# EAGLE schematic Arduino-Pro-v16 (EAGLE 7.6.0)
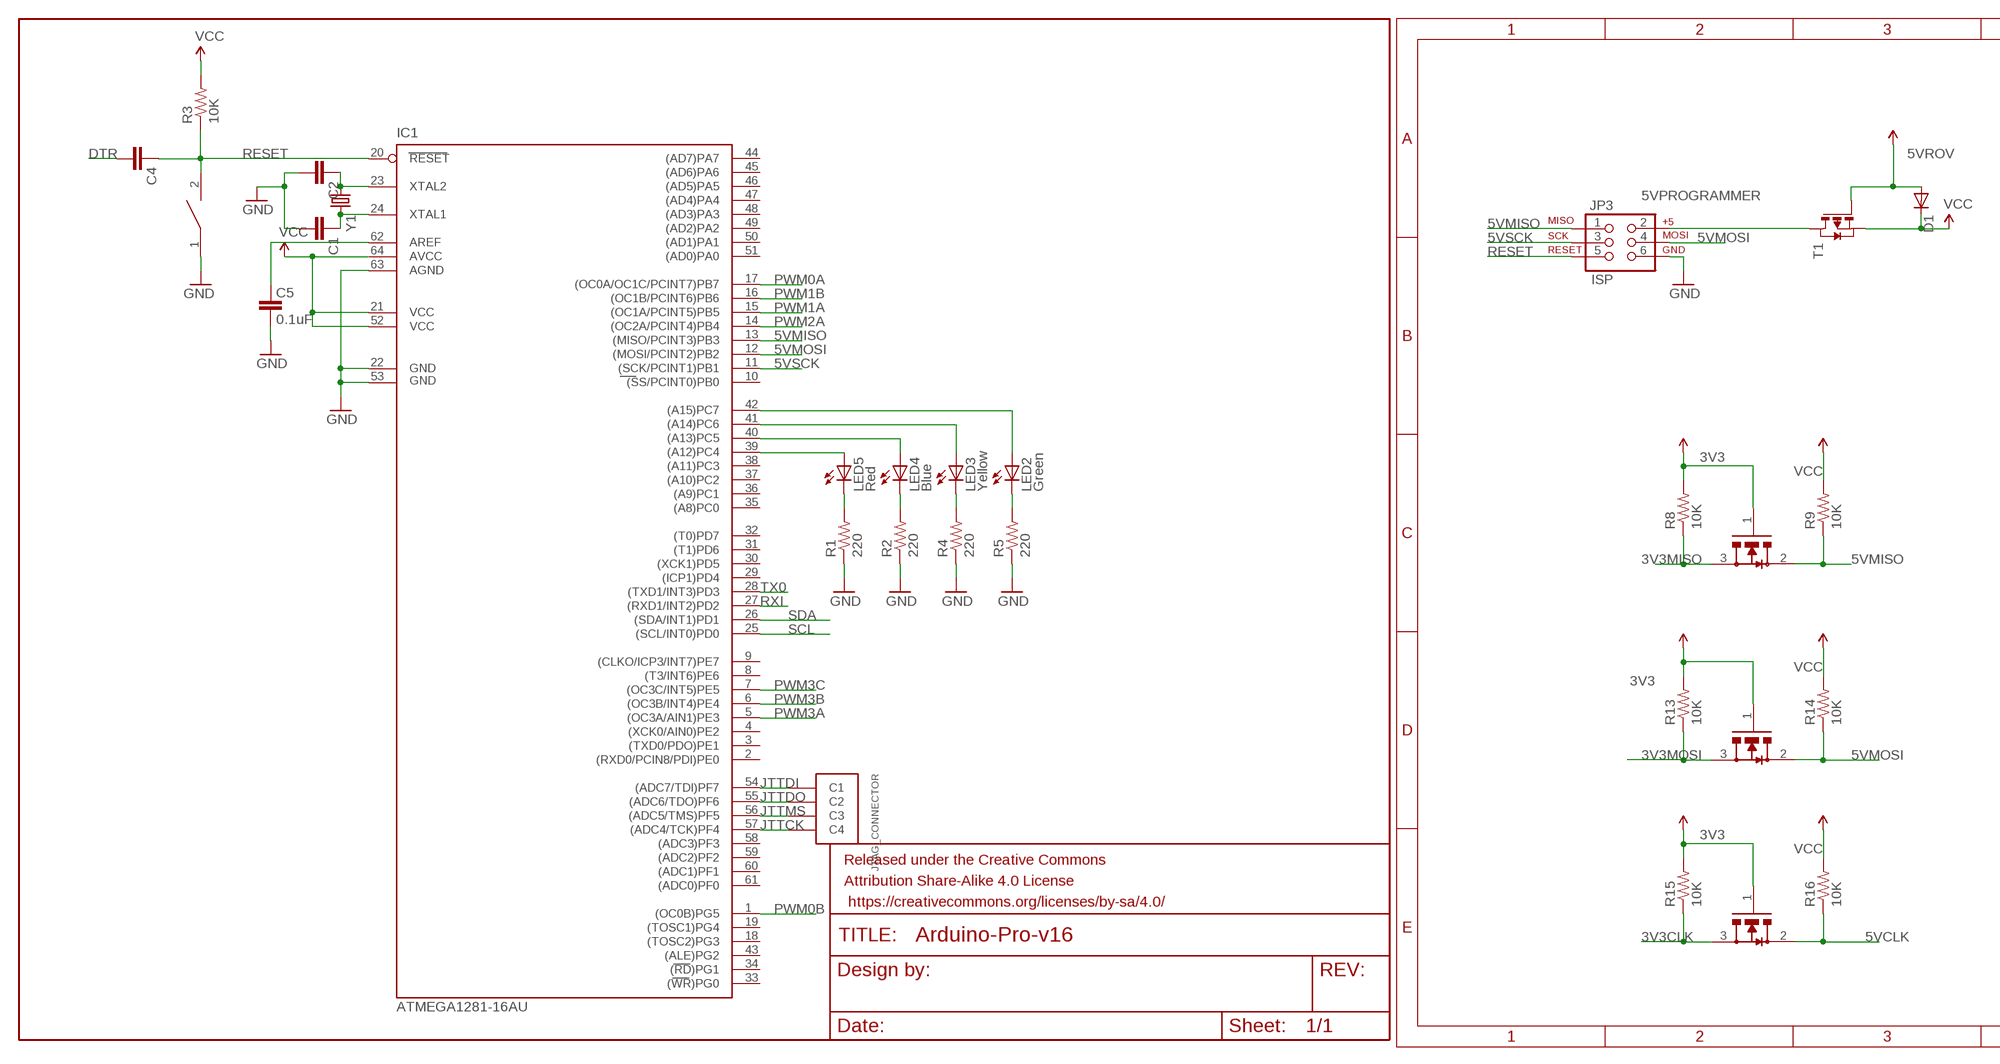
[diagram p0: schematic, sheet 1, part 1 of 2]
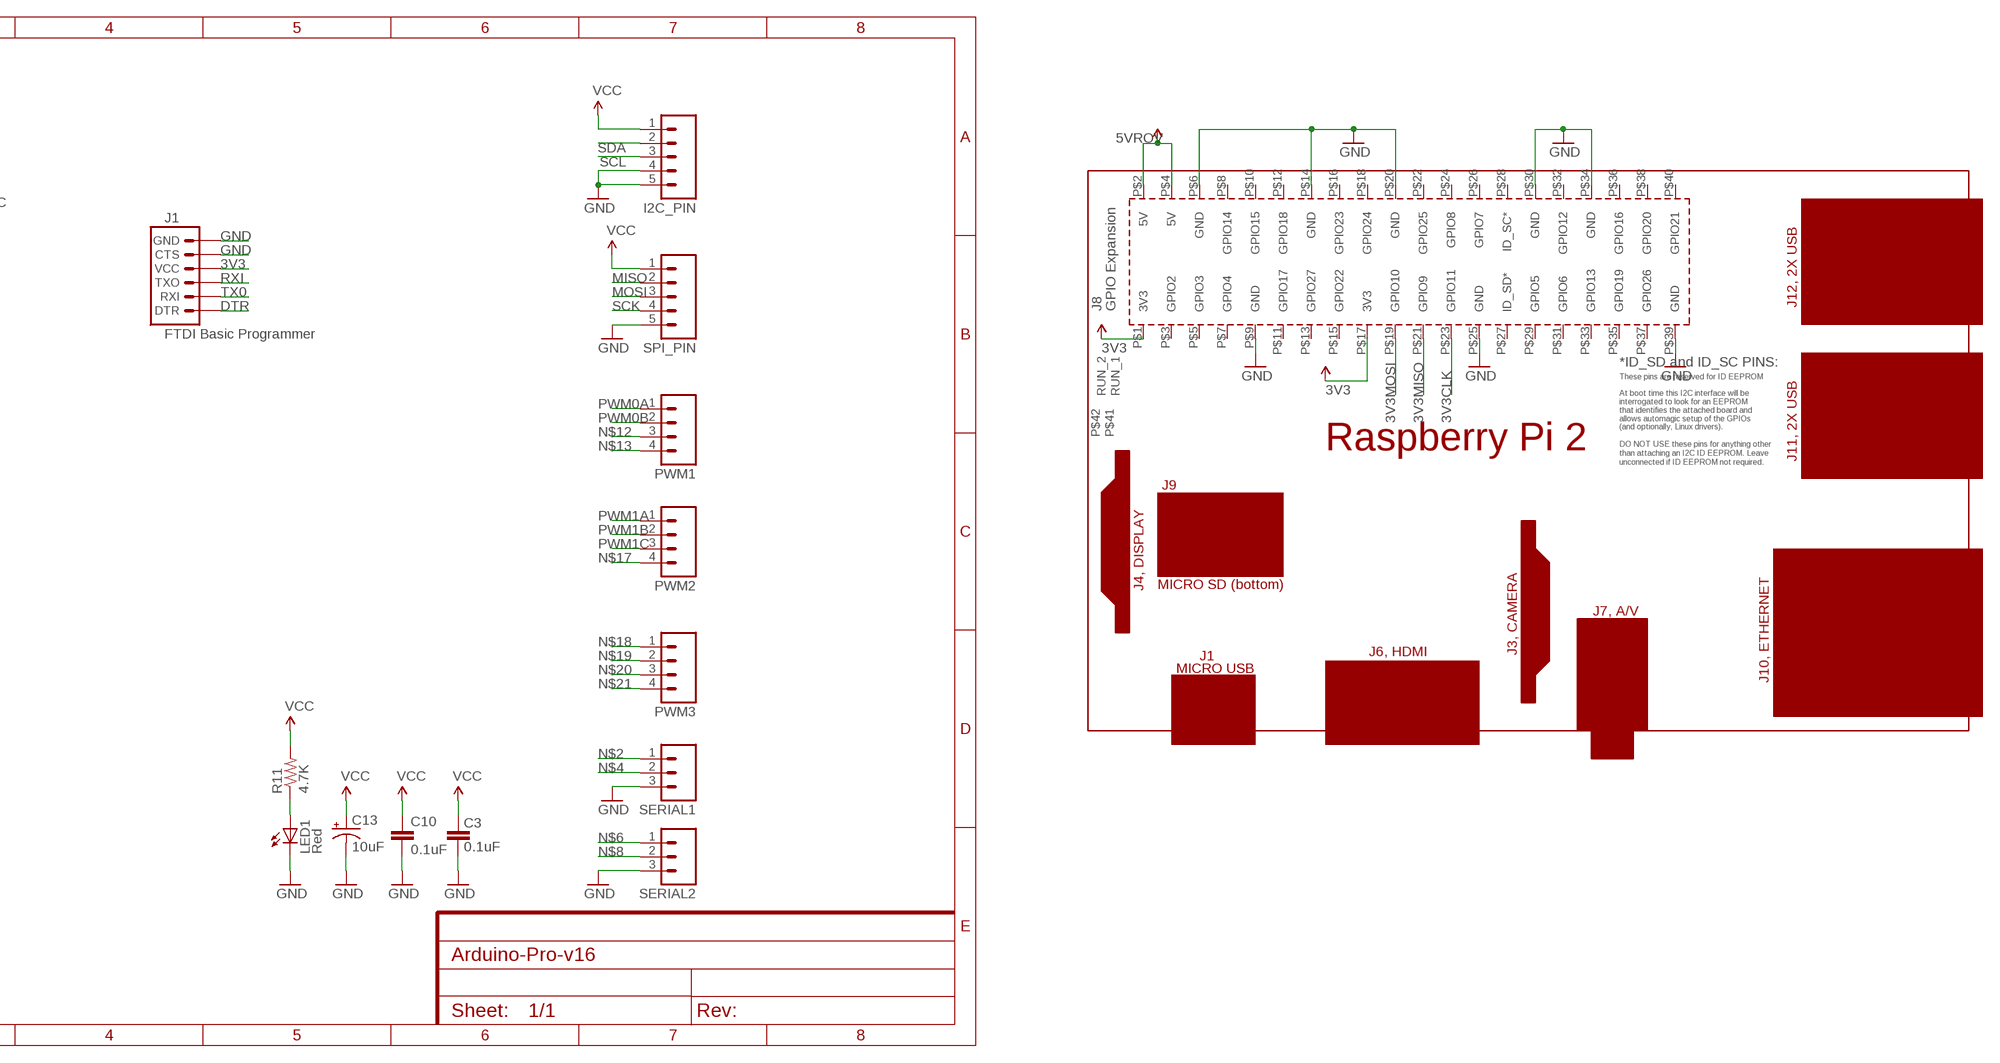
[diagram p1: schematic, sheet 1, part 2 of 2]

## Parts
C1  CAP0603-CAP  [0603-CAP]
C2  CAP0603-CAP  [0603-CAP]
C3  0.1uF  CAP0402-CAP  [0402-CAP]
C4  CAP0603-CAP  [0603-CAP]
C5  0.1uF  CAP0402-CAP  [0402-CAP]
C10  0.1uF  CAP0402-CAP  [0402-CAP]
C13  10uF  CAP_POL1206  [EIA3216]
D1  DIODE-DO-214AC  [DO-214AC]
FRAME1  FRAME-LETTER  [CREATIVE_COMMONS]
I2C_PIN  M05PTH  [1X05]
IC1  ATMEGA1281-16AU  [TQFP64]
J1  FTDI Basic Programmer  ARDUINO_SERIAL_PROGRAMPTH  [1X06]
JP3  ISP  AVR_SPI_PRG_6PTH  [2X3]
JTAG_CONNECTOR  MICRO-FIT-4-SMD-PART  [MICRO-FIT-4-SMD]
LED1  Red  LED0603  [LED-0603]
LED2  Green  LED0603  [LED-0603]
LED3  Yellow  LED0603  [LED-0603]
LED4  Blue  LED0603  [LED-0603]
LED5  Red  LED0603  [LED-0603]
PCB1  RPI2  [RPI2]
PWM1  M04PTH  [1X04]
PWM2  M04PTH  [1X04]
PWM3  M04PTH  [1X04]
R1  220  RESISTOR0402-RES  [0402-RES]
R2  220  RESISTOR0402-RES  [0402-RES]
R3  10K  RESISTOR0603-RES  [0603-RES]
R4  220  RESISTOR0402-RES  [0402-RES]
R5  220  RESISTOR0402-RES  [0402-RES]
R8  10K  RESISTOR0402-RES  [0402-RES]
R9  10K  RESISTOR0402-RES  [0402-RES]
R11  4.7K  RESISTOR0402-RES  [0402-RES]
R13  10K  RESISTOR0402-RES  [0402-RES]
R14  10K  RESISTOR0402-RES  [0402-RES]
R15  10K  RESISTOR0402-RES  [0402-RES]
R16  10K  RESISTOR0402-RES  [0402-RES]
SERIAL1  M03PTH  [1X03]
SERIAL2  M03PTH  [1X03]
SPI_PIN  M05PTH  [1X05]
T1  FDN340P  [SOT-23]
U$1  SWITCH  [SW_2512]
U$3  BSS138  [SOT-23-BSS138]
U$4  BSS138  [SOT-23-BSS138]
U$6  BSS138  [SOT-23-BSS138]
Y1  CRYSTALHC49US  [HC49US]

## Nets
3V3: J1.4(VCC) PCB1.P$1(3V3) PCB1.P$17(3V3) R8.2 R13.2 R15.2 U$3.1(G) U$4.1(G) U$6.1(G) ; supply symbol labelled VCCA
3V3CLK: PCB1.P$23(GPIO11) R15.1 U$6.3(S)
3V3MISO: PCB1.P$21(GPIO9) R8.1 U$3.3(S)
3V3MOSI: PCB1.P$19(GPIO10) R13.1 U$4.3(S)
5VCLK: R16.1 U$6.2(D)
5VMISO: IC1.13((MISO/PCINT3)PB3) JP3.1 R9.1 U$3.2(D)
5VMOSI: IC1.12((MOSI/PCINT2)PB2) JP3.4 R14.1 U$4.2(D)
5VPROGRAMMER: JP3.2 T1.1(D)
5VROV: D1.A PCB1.P$2(5V) PCB1.P$4(5V) T1.3(G) ; supply symbol labelled VCCA
5VSCK: IC1.11((SCK/PCINT1)PB1) JP3.3
DTR: C4.2 J1.1(DTR)
GND [vcc]: C1.2 C2.2 C3.1 C5.1 C10.2 C13.C(-) I2C_PIN.4 I2C_PIN.5 IC1.22(GND) IC1.53(GND1) IC1.63(AGND) J1.5(CTS) J1.6(GND) JP3.6 LED1.C PCB1.P$6(GND) PCB1.P$9(GND) PCB1.P$14(GND) PCB1.P$20(GND) PCB1.P$25(GND) PCB1.P$30(GND) PCB1.P$34(GND) PCB1.P$39(GND) R1.1 R2.1 R4.1 R5.1 SERIAL1.3 SERIAL2.3 SPI_PIN.5 U$1.1
JTTCK: IC1.57((ADC4/TCK)PF4) JTAG_CONNECTOR.C4
JTTDI: IC1.54((ADC7/TDI)PF7) JTAG_CONNECTOR.C1
JTTDO: IC1.55((ADC6/TDO)PF6) JTAG_CONNECTOR.C2
JTTMS: IC1.56((ADC5/TMS)PF5) JTAG_CONNECTOR.C3
MISO: SPI_PIN.2
MOSI: SPI_PIN.3
N$1: C1.1 IC1.24(XTAL1) Y1.2
N$2: SERIAL1.1
N$3: C2.1 IC1.23(XTAL2) Y1.1
N$4: SERIAL1.2
N$5: IC1.39((A12)PC4) LED5.A
N$6: SERIAL2.1
N$7: C5.2 IC1.62(AREF)
N$8: SERIAL2.2
N$9: IC1.40((A13)PC5) LED4.A
N$10: IC1.41((A14)PC6) LED3.A
N$11: IC1.42((A15)PC7) LED2.A
N$12: PWM1.3
N$13: PWM1.4
N$14: LED5.C R1.2
N$15: LED4.C R2.2
N$16: LED3.C R4.2
N$17: PWM2.4
N$18: PWM3.1
N$19: PWM3.2
N$20: PWM3.3
N$21: PWM3.4
N$22: LED2.C R5.2
N$38: LED1.A R11.1
PWM0A: IC1.17((OC0A/OC1C/PCINT7)PB7) PWM1.1
PWM0B: IC1.1((OC0B)PG5) PWM1.2
PWM1A: IC1.15((OC1A/PCINT5)PB5) PWM2.1
PWM1B: IC1.16((OC1B/PCINT6)PB6) PWM2.2
PWM1C: PWM2.3
PWM2A: IC1.14((OC2A/PCINT4)PB4)
PWM3A: IC1.5((OC3A/AIN1)PE3)
PWM3B: IC1.6((OC3B/INT4)PE4)
PWM3C: IC1.7((OC3C/INT5)PE5)
RESET: C4.1 IC1.20(RESET) JP3.5 R3.1 U$1.2
RXI: IC1.27((RXD1/INT2)PD2) J1.3(TXO)
SCK: SPI_PIN.4
SCL: I2C_PIN.3 IC1.25((SCL/INT0)PD0)
SDA: I2C_PIN.2 IC1.26((SDA/INT1)PD1)
TX0: IC1.28((TXD1/INT3)PD3) J1.2(RXI)
VCC: C3.2 C10.1 C13.A(+) D1.C I2C_PIN.1 IC1.21(VCC) IC1.52(VCC1) IC1.64(AVCC) R3.2 R9.2 R11.2 R14.2 R16.2 SPI_PIN.1 T1.2(S) ; supply symbol labelled VCCA
Unconnected: IC1.2((RXD0/PCIN8/PDI)PE0) IC1.3((TXD0/PDO)PE1) IC1.4((XCK0/AIN0)PE2) IC1.8((T3/INT6)PE6) IC1.9((CLKO/ICP3/INT7)PE7) IC1.10((SS/PCINT0)PB0) IC1.18((TOSC2)PG3) IC1.19((TOSC1)PG4) IC1.29((ICP1)PD4) IC1.30((XCK1)PD5) IC1.31((T1)PD6) IC1.32((T0)PD7) IC1.33((WR)PG0) IC1.34((RD)PG1) IC1.35((A8)PC0) IC1.36((A9)PC1) IC1.37((A10)PC2) IC1.38((A11)PC3) IC1.43((ALE)PG2) IC1.44((AD7)PA7) IC1.45((AD6)PA6) IC1.46((AD5)PA5) IC1.47((AD4)PA4) IC1.48((AD3)PA3) IC1.49((AD2)PA2) IC1.50((AD1)PA1) IC1.51((AD0)PA0) IC1.58((ADC3)PF3) IC1.59((ADC2)PF2) IC1.60((ADC1)PF1) IC1.61((ADC0)PF0) PCB1.P$3(GPIO2) PCB1.P$5(GPIO3) PCB1.P$7(GPIO4) PCB1.P$8(GPIO14) PCB1.P$10(GPIO15) PCB1.P$11(GPIO17) PCB1.P$12(GPIO18) PCB1.P$13(GPIO27) PCB1.P$15(GPIO22) PCB1.P$16(GPIO23) PCB1.P$18(GPIO24) PCB1.P$22(GPIO25) PCB1.P$24(GPIO8) PCB1.P$26(GPIO7) PCB1.P$27(ID_SD*) PCB1.P$28(ID_SC*) PCB1.P$29(GPIO5) PCB1.P$31(GPIO6) PCB1.P$32(GPIO12) PCB1.P$33(GPIO13) PCB1.P$35(GPIO19) PCB1.P$36(GPIO16) PCB1.P$37(GPIO26) PCB1.P$38(GPIO20) PCB1.P$40(GPIO21) PCB1.P$41(RUN_1) PCB1.P$42(RUN_2)

## Library data of the parts
C1 C2 C4 = SparkFun-Capacitors:CAP: Capacitor Standard 0603 ceramic capacitor, and 0.1" leaded capacitor.
C3 C5 C10 = SparkFun:CAP: Capacitor Standard 0603 ceramic capacitor, and 0.1" leaded capacitor.
C13 = SparkFun:CAP_POL: Capacitor Polarized These are standard SMD and PTH capacitors. Normally 10uF, 47uF, and 100uF in electrolytic and tantalum varieties. Always verify the external diameter of the through hole cap, it varies with capacity, voltage, and manufacturer. The EIA devices should be standard.
D1 = DiscreteComponents:DIODE-: DIODE
FRAME1 = SparkFun-Aesthetics:FRAME-LETTER: Schematic Frame Standard 8.5x11 US Letter frame
I2C_PIN SPI_PIN = SparkFun-Connectors:M05: Header 5 Standard 5-pin 0.1" header. Use with straight break away headers (SKU : PRT-00116), right angle break away headers (PRT-00553), swiss pins (PRT-00743), machine pins (PRT-00117), and female headers (PRT-00115). Molex polarized connector foot print use with SKU : PRT-08230 with associated crimp pins and housings.
IC1 = atmel-2005:ATMEGA1281*: MICROCONTROLLER 128 Kbytes FLASH 4 Kbytes EEPROM 8 Kbytes SRAM 54 General Purpose I/O pins 6-channels 16-bit PWM 2 x Serial USARTs 8-channels 10-bit A/D
J1 = SparkFun-Connectors:ARDUINO_SERIAL_PROGRAM: FTDI connector footprints
JP3 = SparkFun:AVR_SPI_PRG_6: AVR ISP 6 Pin This is the reduced ISP connector for AVR programming. Common on Arduino. This footprint will take up less PCB space and can be used with a 10-pin to 6-pin adapter such as SKU: BOB-08508
JTAG_CONNECTOR = Connectors:MICRO-FIT-4-SMD: 4 Pin Molex connector; DIGIKEY-CONTACT-PN: WM1125CT-ND; DIGIKEY-FEMALE-PN: WM2640CT-ND; DIGIKEY-MALE-PN: WM1847-ND
LED1-LED5 = SparkFun:LED: LEDs Standard schematic elements and footprints for 5mm, 3mm, 1206, and 0603 sized LEDs. 5mm - Spark Fun Electronics SKU : COM-00529 (and others)
PCB1 = e14_Rpi2_RevA:RPI2: Device for Raspberry Pi 2 board created by www.element14.com More information and support community is available at http://www.element14.com/community/community/raspberry-pi/raspberrypi2
PWM1-PWM3 = SparkFun-Connectors:M04: Header 4 Standard 4-pin 0.1" header. Use with straight break away headers (SKU : PRT-00116), right angle break away headers (PRT-00553), swiss pins (PRT-00743), machine pins (PRT-00117), and female headers (PRT-00115). Molex polarized connector foot print use with SKU : PRT-08231 with associated crimp pins and housings. 1MM SMD Version SKU: PRT-10208; PROD_ID: CONN-09696
R1 R2 R4 R5 R8 R9 R11 R13-R16 = SparkFun:RESISTOR: Resistor Basic schematic elements and footprints for 0603, 1206, and PTH resistors.
R3 = SparkFun-Passives:RESISTOR: Resistor Basic schematic elements and footprints for 0603, 1206, and PTH resistors.
SERIAL1 SERIAL2 = SparkFun-Connectors:M03: Header 3 Standard 3-pin 0.1" header. Use with straight break away headers (SKU : PRT-00116), right angle break away headers (PRT-00553), swiss pins (PRT-00743), machine pins (PRT-00117), and female headers (PRT-00115). Molex polarized connector foot print use with SKU : PRT-08232 with associated crimp pins and housings.
T1 = DiscreteComponents:FDN340P: MOS FET; DIGIKEY: FDN340PCT-ND
U$1 = DiscreteComponents:SWITCH
U$3 U$4 U$6 = DiscreteComponents:BSS138: n-channel mosfet
Y1 = SparkFun-FreqCtrl:CRYSTAL: Various standard crystals. Proven footprints.

## Net classes
0 default: width 0.203 mm
1 vcc: width 0.254 mm